# Altium schematic sheet MICROCONTROLLER.SchDoc: Microcontroller
size A3; CompanyName: ARDUINO; Organization: ARDUINO; SheetNumber: 11; SheetTotal: 51; RevAuthor: Silvio Navaretti
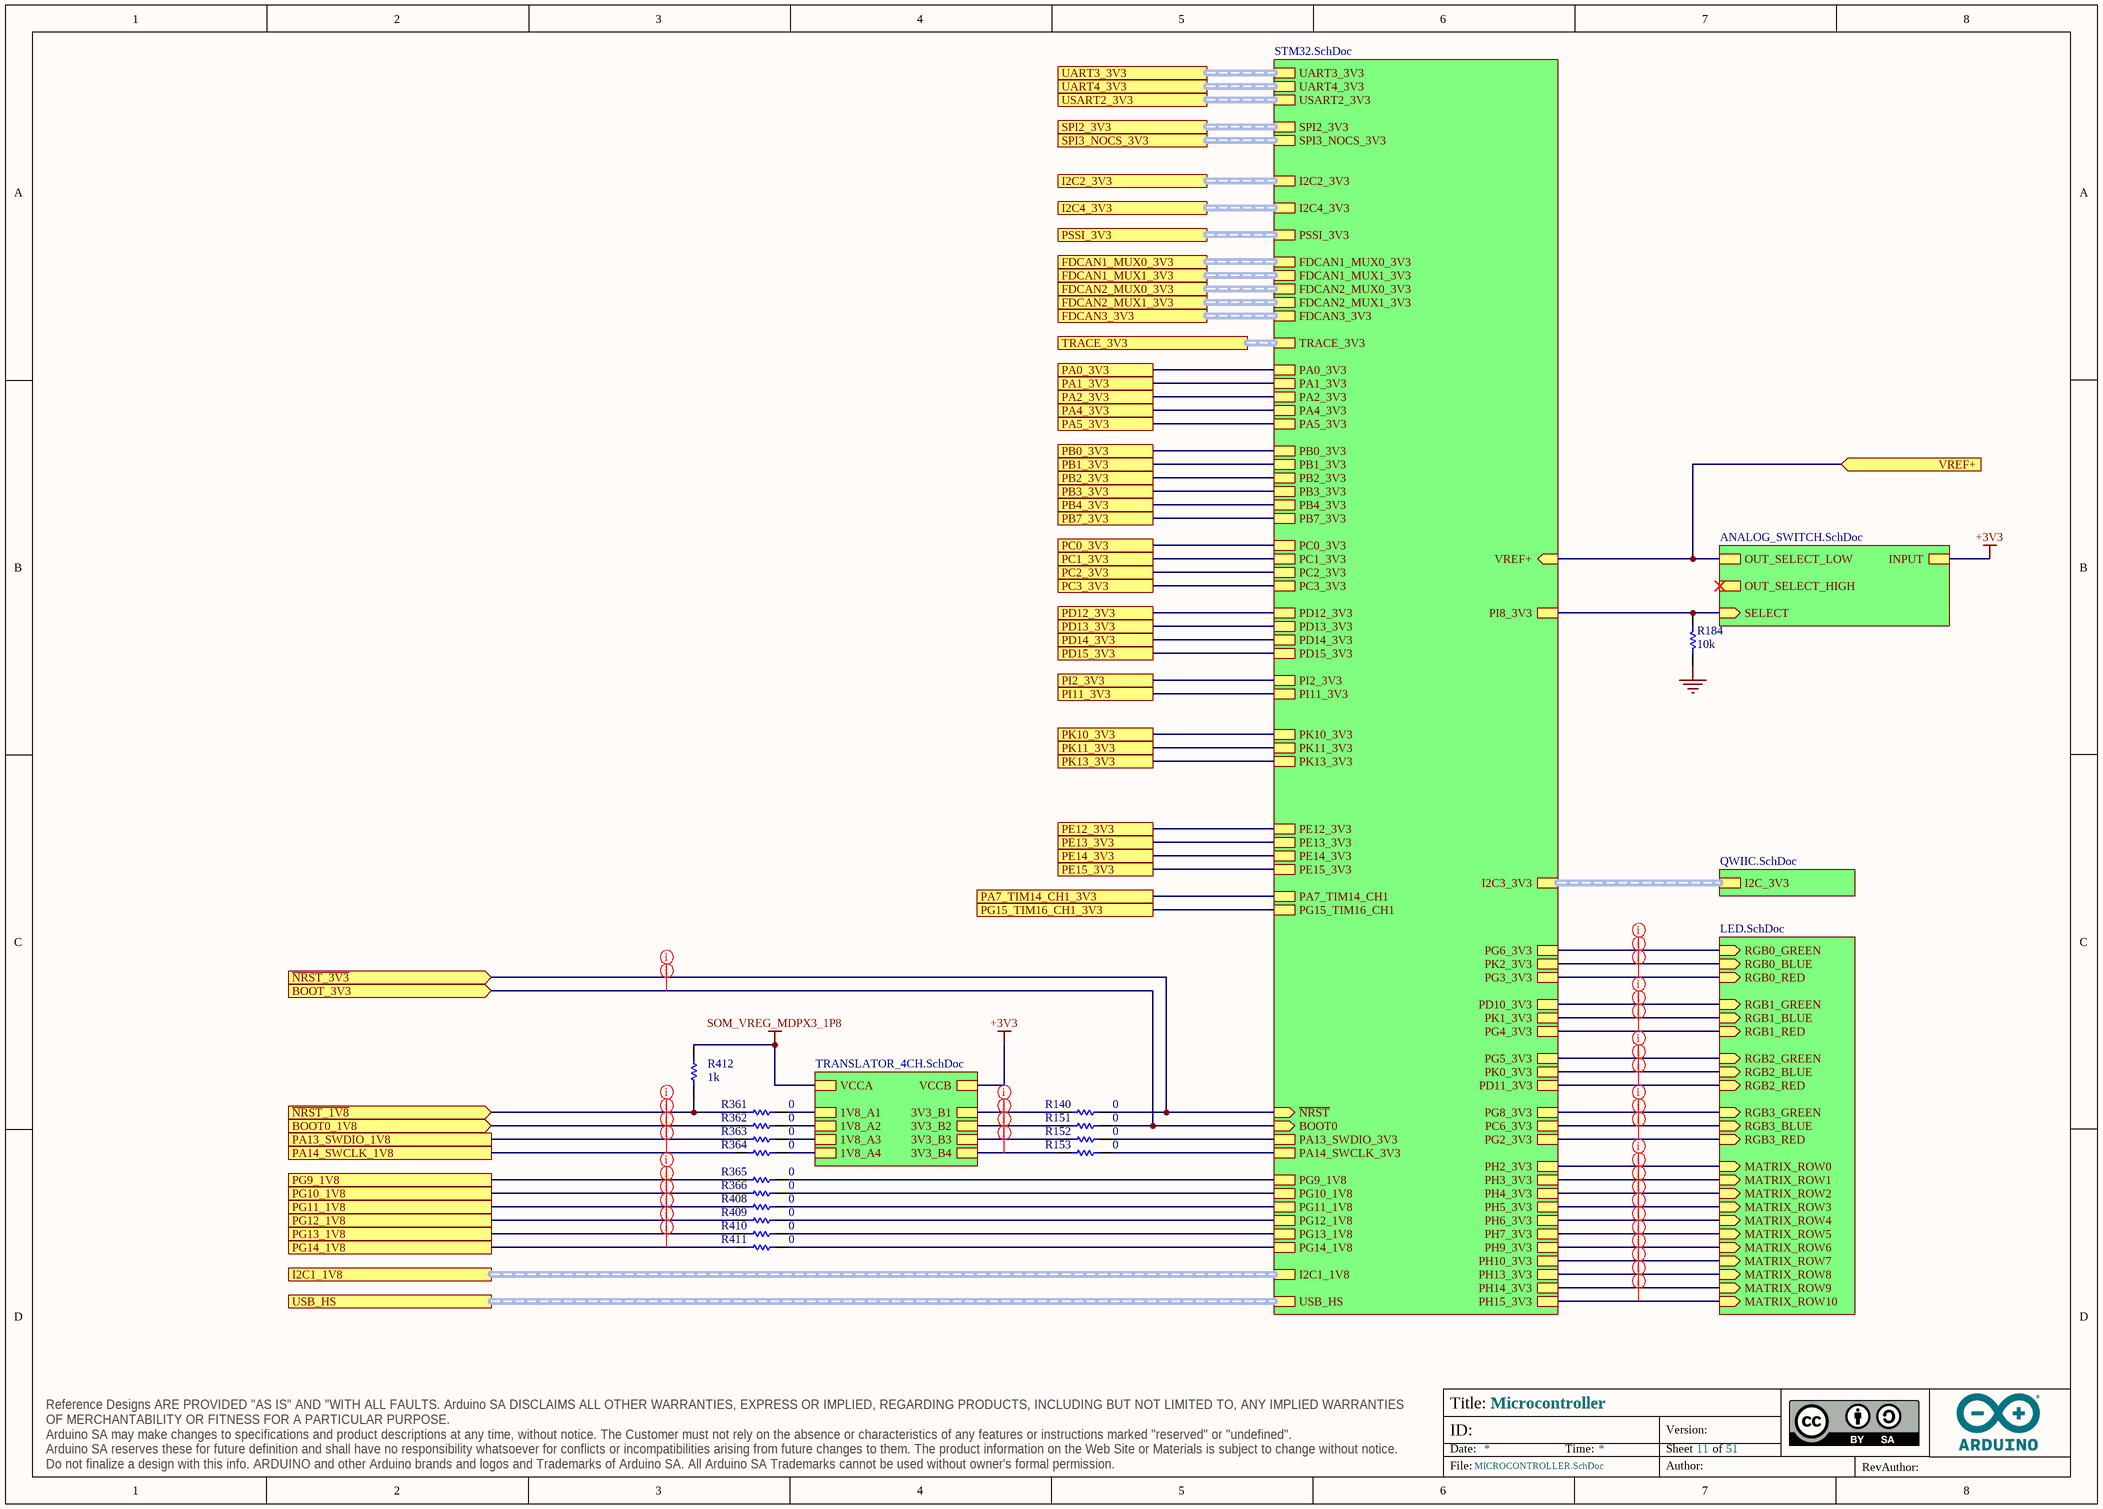
[diagram p0: MICROCONTROLLER.SchDoc]

## Parts
R140  value 0  [RES-0201]  (hidden comment: CRCW02010000Z0ED)
R151  value 0  [RES-0201]  (hidden comment: CRCW02010000Z0ED)
R152  value 0  [RES-0201]  (hidden comment: CRCW02010000Z0ED)
R153  value 0  [RES-0201]  (hidden comment: CRCW02010000Z0ED)
R184  value 10k  [RES-0201]  (hidden comment: RC0201FR-0710KL)
R361  value 0  [RES-0201]  (hidden comment: CRCW02010000Z0ED)
R362  value 0  [RES-0201]  (hidden comment: CRCW02010000Z0ED)
R363  value 0  [RES-0201]  (hidden comment: CRCW02010000Z0ED)
R364  value 0  [RES-0201]  (hidden comment: CRCW02010000Z0ED)
R365  value 0  [RES-0201]  (hidden comment: CRCW02010000Z0ED)
R366  value 0  [RES-0201]  (hidden comment: CRCW02010000Z0ED)
R408  value 0  [RES-0201]  (hidden comment: CRCW02010000Z0ED)
R409  value 0  [RES-0201]  (hidden comment: CRCW02010000Z0ED)
R410  value 0  [RES-0201]  (hidden comment: CRCW02010000Z0ED)
R411  value 0  [RES-0201]  (hidden comment: CRCW02010000Z0ED)
R412  value 1k  [RES-0201]  (hidden comment: RC0201FR-071KL)

## Sub-sheets
U_ANALOG_SWITCH = ANALOG_SWITCH.SchDoc: SELECT (in), OUT_SELECT_LOW, OUT_SELECT_HIGH, INPUT
U_LED = LED.SchDoc: RGB0_GREEN (in), RGB0_BLUE (in), RGB0_RED (in), RGB1_GREEN (in), RGB1_BLUE (in), RGB1_RED (in), RGB2_GREEN (in), RGB2_BLUE (in), RGB2_RED (in), RGB3_GREEN (in), RGB3_BLUE (in), RGB3_RED (in), MATRIX_ROW0 (in), MATRIX_ROW1 (in), MATRIX_ROW2 (in), MATRIX_ROW3 (in), MATRIX_ROW4 (in), MATRIX_ROW5 (in), MATRIX_ROW6 (in), MATRIX_ROW7 (in), MATRIX_ROW8 (in), MATRIX_ROW9 (in), MATRIX_ROW10 (in)
U_QWIIC = QWIIC.SchDoc: I2C_3V3 (harness I2C)
U_STM32 = STM32.SchDoc: USB_HS (harness SOM_MD_USB1), ~{NRST} (in), BOOT0 (in), UART3_3V3 (harness UART), PB2_3V3, PB3_3V3, FDCAN2_MUX0_3V3 (harness CAN), PB0_3V3, PB1_3V3, PB4_3V3, PB7_3V3, SPI2_3V3 (harness SPI), PA0_3V3, PA1_3V3, I2C2_3V3 (harness I2C), PA2_3V3, UART4_3V3 (harness UART), PSSI_3V3 (harness PSSI), PA4_3V3, PA5_3V3, PE12_3V3, PE13_3V3, PE14_3V3, PE15_3V3, FDCAN1_MUX0_3V3 (harness CAN), FDCAN2_MUX1_3V3 (harness CAN), PC0_3V3, PC1_3V3, PC2_3V3, PC3_3V3, PH2_3V3, PH3_3V3, PH4_3V3, PH5_3V3, PH6_3V3, PH7_3V3, PH9_3V3, PH13_3V3, PH14_3V3, PH15_3V3, VREF+ (in), SPI3_NOCS_3V3 (harness JSPI_SPI), I2C4_3V3 (harness I2C), PG9_1V8, PG10_1V8, PG11_1V8, PG12_1V8, PG13_1V8, PG14_1V8, I2C3_3V3 (harness I2C), I2C1_1V8 (harness I2C), PA13_SWDIO_3V3, PA14_SWCLK_3V3, TRACE_3V3 (harness MCU_TRACE), USART2_3V3 (harness UART), PA7_TIM14_CH1, PG15_TIM16_CH1, FDCAN3_3V3 (harness CAN), FDCAN1_MUX1_3V3 (harness CAN), PD12_3V3, PD13_3V3, PD14_3V3, PD15_3V3, PI2_3V3, PI11_3V3, PI8_3V3, PG2_3V3, PK0_3V3, PK1_3V3, PK2_3V3, PD10_3V3, PD11_3V3, PG3_3V3, PG4_3V3, PG5_3V3, PG6_3V3, PC6_3V3, PG8_3V3, PH10_3V3, PK13_3V3, PK10_3V3, PK11_3V3
U_TRANSLATOR_4CH = TRANSLATOR_4CH.SchDoc: 1V8_A1, 1V8_A2, 1V8_A3, 1V8_A4, 3V3_B1, 3V3_B2, 3V3_B3, 3V3_B4, VCCA, VCCB

## Ports
BOOT0_1V8 (in), BOOT_3V3 (in), FDCAN1_MUX0_3V3, FDCAN1_MUX1_3V3, FDCAN2_MUX0_3V3, FDCAN2_MUX1_3V3, FDCAN3_3V3, I2C1_1V8, I2C2_3V3, I2C4_3V3, PA0_3V3, PA1_3V3, PA2_3V3, PA4_3V3, PA5_3V3, PA7_TIM14_CH1_3V3, PA13_SWDIO_1V8, PA14_SWCLK_1V8, PB0_3V3, PB1_3V3, PB2_3V3, PB3_3V3, PB4_3V3, PB7_3V3, PC0_3V3, PC1_3V3, PC2_3V3, PC3_3V3, PD12_3V3, PD13_3V3, PD14_3V3, PD15_3V3, PE12_3V3, PE13_3V3, PE14_3V3, PE15_3V3, PG9_1V8, PG10_1V8, PG11_1V8, PG12_1V8, PG13_1V8, PG14_1V8, PG15_TIM16_CH1_3V3, PI2_3V3, PI11_3V3, PK10_3V3, PK11_3V3, PK13_3V3, PSSI_3V3, SPI2_3V3, SPI3_NOCS_3V3, TRACE_3V3, UART3_3V3, UART4_3V3, USART2_3V3, USB_HS, VREF+ (in), ~{NRST_1V8} (in), ~{NRST_3V3} (in)

## Nets
+3V3: sheet U_ANALOG_SWITCH/INPUT, sheet U_TRANSLATOR_4CH/VCCB
GND: R184.1
SOM_VREG_MDPX3_1P8: R412.1 ; sheet U_TRANSLATOR_4CH/VCCA
BOOT0_1V8: R362.2 ; port BOOT0_1V8
BOOT_3V3: R151.1 ; port BOOT_3V3, sheet U_STM32/BOOT0
~{NRST_1V8}: R361.2 R412.2 ; port ~{NRST_1V8}
~{NRST_3V3}: R140.1 ; port ~{NRST_3V3}, sheet U_STM32/~{NRST}
PA0_3V3: port PA0_3V3, sheet U_STM32/PA0_3V3
PA1_3V3: port PA1_3V3, sheet U_STM32/PA1_3V3
PA2_3V3: port PA2_3V3, sheet U_STM32/PA2_3V3
PA4_3V3: port PA4_3V3, sheet U_STM32/PA4_3V3
PA5_3V3: port PA5_3V3, sheet U_STM32/PA5_3V3
PA7_TIM14_CH1_3V3: port PA7_TIM14_CH1_3V3, sheet U_STM32/PA7_TIM14_CH1
PA13_SWDIO_1V8: R363.2 ; port PA13_SWDIO_1V8
PA14_SWCLK_1V8: R364.2 ; port PA14_SWCLK_1V8
PB0_3V3: port PB0_3V3, sheet U_STM32/PB0_3V3
PB1_3V3: port PB1_3V3, sheet U_STM32/PB1_3V3
PB2_3V3: port PB2_3V3, sheet U_STM32/PB2_3V3
PB3_3V3: port PB3_3V3, sheet U_STM32/PB3_3V3
PB4_3V3: port PB4_3V3, sheet U_STM32/PB4_3V3
PB7_3V3: port PB7_3V3, sheet U_STM32/PB7_3V3
PC0_3V3: port PC0_3V3, sheet U_STM32/PC0_3V3
PC1_3V3: port PC1_3V3, sheet U_STM32/PC1_3V3
PC2_3V3: port PC2_3V3, sheet U_STM32/PC2_3V3
PC3_3V3: port PC3_3V3, sheet U_STM32/PC3_3V3
PD12_3V3: port PD12_3V3, sheet U_STM32/PD12_3V3
PD13_3V3: port PD13_3V3, sheet U_STM32/PD13_3V3
PD14_3V3: port PD14_3V3, sheet U_STM32/PD14_3V3
PD15_3V3: port PD15_3V3, sheet U_STM32/PD15_3V3
PE12_3V3: port PE12_3V3, sheet U_STM32/PE12_3V3
PE13_3V3: port PE13_3V3, sheet U_STM32/PE13_3V3
PE14_3V3: port PE14_3V3, sheet U_STM32/PE14_3V3
PE15_3V3: port PE15_3V3, sheet U_STM32/PE15_3V3
PG9_1V8: R365.2 ; port PG9_1V8
PG10_1V8: R366.2 ; port PG10_1V8
PG11_1V8: R408.2 ; port PG11_1V8
PG12_1V8: R409.2 ; port PG12_1V8
PG13_1V8: R410.2 ; port PG13_1V8
PG14_1V8: R411.2 ; port PG14_1V8
PG15_TIM16_CH1_3V3: port PG15_TIM16_CH1_3V3, sheet U_STM32/PG15_TIM16_CH1
PI2_3V3: port PI2_3V3, sheet U_STM32/PI2_3V3
PI11_3V3: port PI11_3V3, sheet U_STM32/PI11_3V3
PK10_3V3: port PK10_3V3, sheet U_STM32/PK10_3V3
PK11_3V3: port PK11_3V3, sheet U_STM32/PK11_3V3
PK13_3V3: port PK13_3V3, sheet U_STM32/PK13_3V3
VREF+: port VREF+, sheet U_STM32/VREF+, sheet U_ANALOG_SWITCH/OUT_SELECT_LOW
NetR140_2: R140.2 ; sheet U_TRANSLATOR_4CH/3V3_B1
NetR151_2: R151.2 ; sheet U_TRANSLATOR_4CH/3V3_B2
NetR152_1: R152.1 ; sheet U_STM32/PA13_SWDIO_3V3
NetR152_2: R152.2 ; sheet U_TRANSLATOR_4CH/3V3_B3
NetR153_1: R153.1 ; sheet U_STM32/PA14_SWCLK_3V3
NetR153_2: R153.2 ; sheet U_TRANSLATOR_4CH/3V3_B4
NetR184_2: R184.2 ; sheet U_STM32/PI8_3V3, sheet U_ANALOG_SWITCH/SELECT
NetR361_1: R361.1 ; sheet U_TRANSLATOR_4CH/1V8_A1
NetR362_1: R362.1 ; sheet U_TRANSLATOR_4CH/1V8_A2
NetR363_1: R363.1 ; sheet U_TRANSLATOR_4CH/1V8_A3
NetR364_1: R364.1 ; sheet U_TRANSLATOR_4CH/1V8_A4
NetR365_1: R365.1 ; sheet U_STM32/PG9_1V8
NetR366_1: R366.1 ; sheet U_STM32/PG10_1V8
NetR408_1: R408.1 ; sheet U_STM32/PG11_1V8
NetR409_1: R409.1 ; sheet U_STM32/PG12_1V8
NetR410_1: R410.1 ; sheet U_STM32/PG13_1V8
NetR411_1: R411.1 ; sheet U_STM32/PG14_1V8
(unnamed): sheet U_STM32/PH2_3V3, sheet U_LED/MATRIX_ROW0
(unnamed): sheet U_STM32/PH3_3V3, sheet U_LED/MATRIX_ROW1
(unnamed): sheet U_STM32/PH4_3V3, sheet U_LED/MATRIX_ROW2
(unnamed): sheet U_STM32/PH5_3V3, sheet U_LED/MATRIX_ROW3
(unnamed): sheet U_STM32/PH6_3V3, sheet U_LED/MATRIX_ROW4
(unnamed): sheet U_STM32/PH7_3V3, sheet U_LED/MATRIX_ROW5
(unnamed): sheet U_STM32/PH9_3V3, sheet U_LED/MATRIX_ROW6
(unnamed): sheet U_STM32/PH13_3V3, sheet U_LED/MATRIX_ROW8
(unnamed): sheet U_STM32/PH14_3V3, sheet U_LED/MATRIX_ROW9
(unnamed): sheet U_STM32/PH15_3V3, sheet U_LED/MATRIX_ROW10
(unnamed): sheet U_STM32/PG2_3V3, sheet U_LED/RGB3_RED
(unnamed): sheet U_STM32/PK0_3V3, sheet U_LED/RGB2_BLUE
(unnamed): sheet U_STM32/PK1_3V3, sheet U_LED/RGB1_BLUE
(unnamed): sheet U_STM32/PK2_3V3, sheet U_LED/RGB0_BLUE
(unnamed): sheet U_STM32/PD10_3V3, sheet U_LED/RGB1_GREEN
(unnamed): sheet U_STM32/PD11_3V3, sheet U_LED/RGB2_RED
(unnamed): sheet U_STM32/PG3_3V3, sheet U_LED/RGB0_RED
(unnamed): sheet U_STM32/PG4_3V3, sheet U_LED/RGB1_RED
(unnamed): sheet U_STM32/PG5_3V3, sheet U_LED/RGB2_GREEN
(unnamed): sheet U_STM32/PG6_3V3, sheet U_LED/RGB0_GREEN
(unnamed): sheet U_STM32/PC6_3V3, sheet U_LED/RGB3_BLUE
(unnamed): sheet U_STM32/PG8_3V3, sheet U_LED/RGB3_GREEN
(unnamed): sheet U_STM32/PH10_3V3, sheet U_LED/MATRIX_ROW7

## Buses and harness runs
harness port FDCAN1_MUX0_3V3 = sheet U_STM32/FDCAN1_MUX0_3V3
harness port FDCAN1_MUX1_3V3 = sheet U_STM32/FDCAN1_MUX1_3V3
harness port FDCAN2_MUX0_3V3 = sheet U_STM32/FDCAN2_MUX0_3V3
harness port FDCAN2_MUX1_3V3 = sheet U_STM32/FDCAN2_MUX1_3V3
harness port FDCAN3_3V3 = sheet U_STM32/FDCAN3_3V3
harness port I2C1_1V8 = sheet U_STM32/I2C1_1V8
harness port I2C2_3V3 = sheet U_STM32/I2C2_3V3
harness port I2C4_3V3 = sheet U_STM32/I2C4_3V3
harness port PSSI_3V3 = sheet U_STM32/PSSI_3V3
harness port SPI2_3V3 = sheet U_STM32/SPI2_3V3
harness port SPI3_NOCS_3V3 = sheet U_STM32/SPI3_NOCS_3V3
harness port TRACE_3V3 = sheet U_STM32/TRACE_3V3
harness port UART3_3V3 = sheet U_STM32/UART3_3V3
harness port UART4_3V3 = sheet U_STM32/UART4_3V3
harness port USART2_3V3 = sheet U_STM32/USART2_3V3
harness port USB_HS = sheet U_STM32/USB_HS
harness sheet U_QWIIC/I2C_3V3 = sheet U_STM32/I2C3_3V3

## Layout directives
net class MICROCONTROLLER: BOOT0_1V8, BOOT_3V3, NetR140_2, NetR151_2, NetR152_2, NetR153_2, PA13_SWDIO_1V8, PA14_SWCLK_1V8, PG9_1V8, PG10_1V8, PG11_1V8, PG12_1V8, PG13_1V8, PG14_1V8, ~{NRST_1V8}, ~{NRST_3V3}
net class MICROCONTROLLER_RGB: (no net found under the mark)
net class MICROCONTROLLER_MATRIX: (no net found under the mark)

## Notes on the sheet
- Title:
- ID:
- Date:
- Time:
- Version:
- Sheet
- of
- RevAuthor:
- Reference Designs ARE PROVIDED "AS IS" AND "WITH ALL FAULTS. Arduino SA DISCLAIMS ALL OTHER WARRANTIES, EXPRESS OR IMPLIED, REGARDING PRODUCTS, INCLUDING BUT NOT LIMITED TO, ANY IMPLIED WARRANTIES OF MERCHANTABILITY OR FITNESS FOR A PARTICULAR PURPOSE.
  Arduino SA may make changes to specifications and product descriptions at any time, without notice. The Customer must not rely on the absence or characteristics of any features or instructions marked "reserved" or "undefined".
  Arduino SA reserves these for future definition and shall have no responsibility whatsoever for conflicts or incompatibilities arising from future changes to them. The product information on the Web Site or Materials is subject to change without notice.
  Do not finalize a design with this info. ARDUINO and other Arduino brands and logos and Trademarks of Arduino SA. All Arduino SA Trademarks cannot be used without owner's formal permission.
- File:
- Author:

## Library data of the parts
R140 R151-R153 R361-R366 R408-R411 = R0140-A.21: RES CHIP 0201 0R; Manufacturer: Vishay; Temperature coefficient: 0ppm; Code Arduino: R0140; Power: 50mW; Tolerance: 0%; Technology: Thick film; Case Code (Imperial): 0201; Part Number: CRCW02010000Z0ED
R184 = R0145-A.21: RES CHIP 0201 10k 1% 1/20W; Manufacturer: Yageo; Power: 50mW; Temperature coefficient: 200ppm; Code Arduino: R0145; Manufacturer 2: Samsung Electro-Mechanics; Tolerance: 1%; Case Code (Imperial): 0201; Part Number: RC0201FR-0710KL; Technology: Thick film
R412 = R0195-A.22: RES CHIP 0201 1k 1% 1/20W; Manufacturer: Yageo; Power: 50mW; Temperature coefficient: 200ppm; Code Arduino: R0195; Tolerance: 1%; Case Code (Imperial): 0201; Part Number: RC0201FR-071KL; Technology: Thick film